# Altium project Do_an_1.PrjPcb
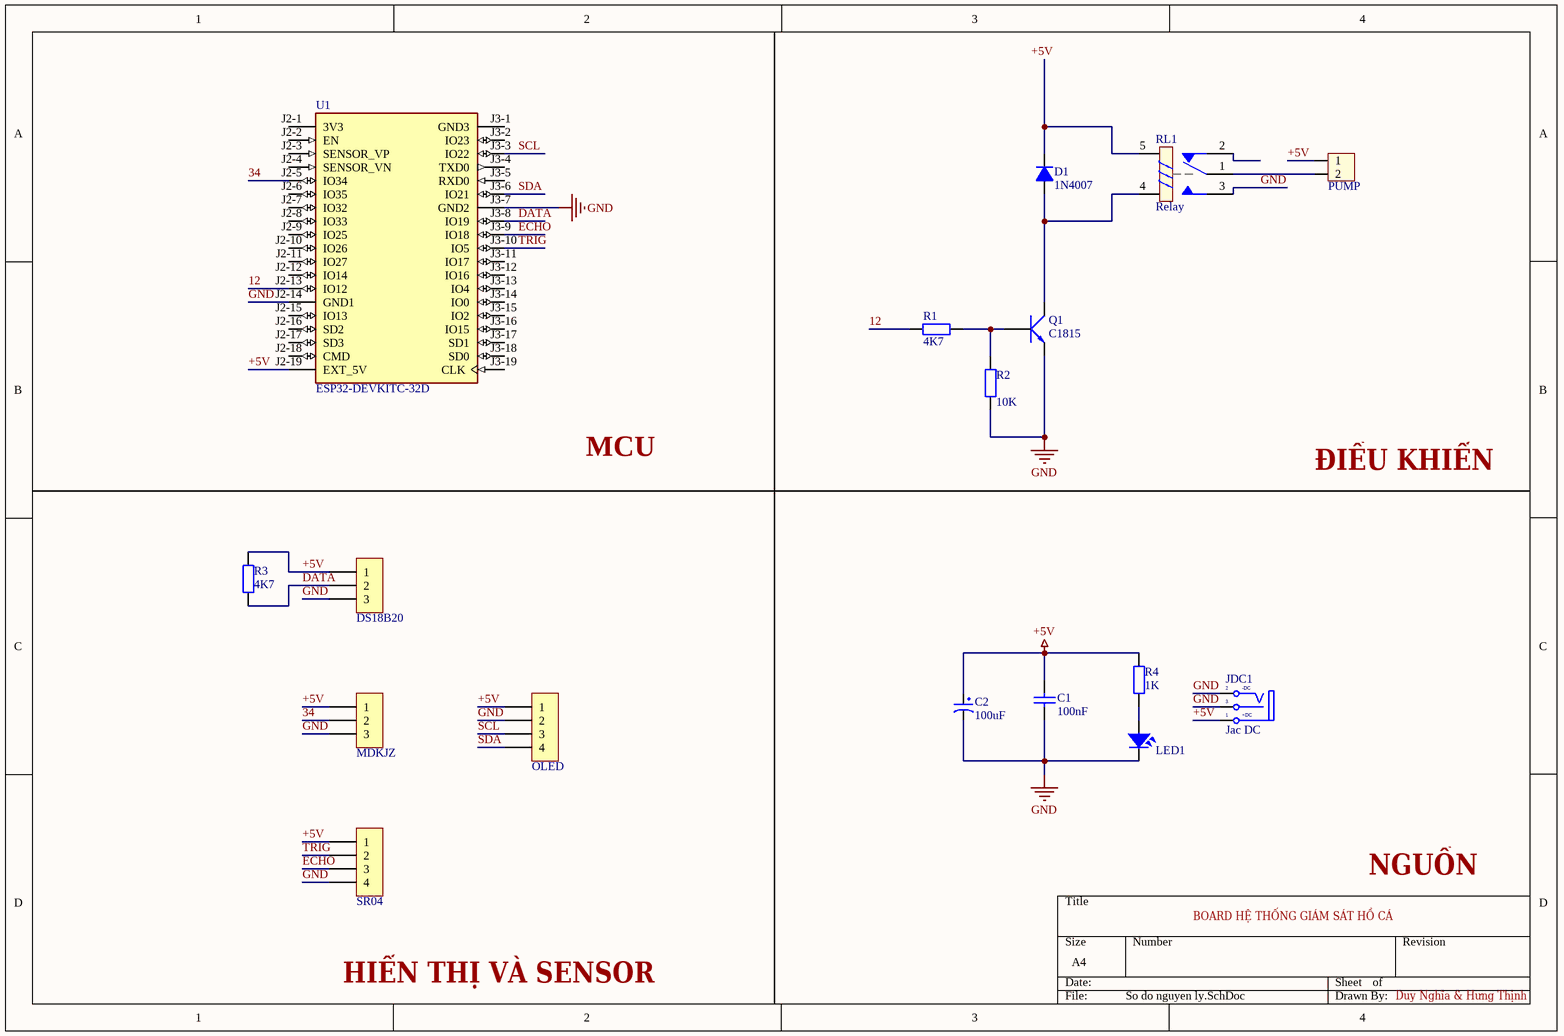
[diagram p0: So do nguyen ly.SchDoc]
1 sheet, 17 parts. Net scope: global (net labels, ports and power ports of the same name join across sheets).
Board file: Final_PCB.PcbDoc

## Sheet So do nguyen ly.SchDoc
size A4; SheetNumber: 1; SheetTotal: 1

### Parts
C1  100nF  [tu gom]
C2  100uF  [tu hoa 5mm]
D1  1N4007  [D1A]
H1  PUMP  [XH2.54M-2]
H2  DS18B20  [Header 3P DC 2.54]
H3  MDKJZ  [Header 3P DC 2.54]
H4  OLED  [XH2.54M-4]
H5  SR04  [XH2.54M-4]
JDC1  Jac DC  [DC-IN]
LED1  LED  [LED-3]  (value not drawn)
Q1  C1815  [TO92]
R1  value 4K7  [AXIAL-0.4]  (hidden comment: Res2)
R2  value 10K  [AXIAL-0.4]  (hidden comment: Res2)
R3  value 4K7  [AXIAL-0.4]  (hidden comment: Res2)
R4  value 1K  [AXIAL-0.4]  (hidden comment: Res2)
RL1  Relay  [RL_SPDT_10A]
U1  ESP32-DEVKITC-32D  [MODULE_ESP32-DEVKITC-32D]

### Nets
+5V: C1.1 C2.1 H1.1 H2.1 H3.1 H4.1 H5.1 JDC1.1(T) R3.2 R4.2 U1.J2-19(EXT_5V)
GND: C1.2 C2.2 H2.3 H3.3 H4.2 H5.4 JDC1.2(TN) JDC1.3(S) LED1.2 Q1.1(E) R2.1 RL1.3 U1.J2-14(GND1) U1.J3-7(GND2)
12: R1.1 U1.J2-13(IO12)
34: H3.2 U1.J2-5(IO34)
DATA: H2.2 R3.1 U1.J3-8(IO19)
ECHO: H5.3 U1.J3-9(IO18)
SCL: H4.3 U1.J3-3(IO22)
SDA: H4.4 U1.J3-6(IO21)
TRIG: H5.2 U1.J3-10(IO5)
NetD1_1: D1.1(A) Q1.2(C) RL1.4
NetD1_2: D1.2(K) RL1.5
NetH1_2: H1.2 RL1.1
NetLED1_1: LED1.1 R4.1
NetQ1_3: Q1.3(B) R1.2 R2.2

Not connected (* = marked no-connect by the designer): RL1 2; U1 J2-1(3V3) J2-2(EN) J2-3(SENSOR_VP) J2-4(SENSOR_VN) J2-6(IO35) J2-7(IO32) J2-8(IO33) J2-9(IO25) J2-10(IO26) J2-11(IO27) J2-12(IO14) J2-15(IO13) J2-16(SD2) J2-17(SD3) J2-18(CMD) J3-1(GND3) J3-2(IO23) J3-4(TXD0) J3-5(RXD0) J3-11(IO17) J3-12(IO16) J3-13(IO4) J3-14(IO0) J3-15(IO2) J3-16(IO15) J3-17(SD1) J3-18(SD0) J3-19(CLK)

### Notes on the sheet
- MCU
- ĐIỀU KHIỂN
- BOARD HỆ THỐNG GIÁM SÁT HỒ CÁ
- NGUỒN
- HIỂN THỊ VÀ SENSOR
- Duy Nghĩa & Hưng Thịnh
- Labels drawn without touching a wire or pin: +5V
- (in symbol DCIN) -DC; +DC

### Library data of the parts
C1 = Tu gom 15pF 50V: Cắm; Don_Vi: Con; So_Chan: 2; Ten_Linh_Kien: Tụ gốm 15P 50V; Ma_Hang: MH004767; Chung_Loai: Cắm; Kieu_Chan: *
C2 = Tu Hoa 100uF 16V 5x7: Cắm; Don_Vi: Con; So_Chan: 2; Ten_Linh_Kien: Tụ Hóa 100uF 16V 5x7MM; Ma_Hang: MH001347; Chung_Loai: Cắm; Kieu_Chan: *
D1 = D1A: Diode 1A; Value: 1N4007
H1 = Header 2P 2.54 Duc Thang: Cắm; Ten_Linh_Kien: Header 2P XH2.54-2P Đực Thẳng; Don_Vi: Con; Ma_Hang: MH001283; Chung_Loai: Cắm
H2 H3 = Header 3P 2.54 Duc Cong: Cắm; Ten_Linh_Kien: Header 3P XH2.54-3P Đực Cong; Don_Vi: Con; Ma_Hang: MH001302; Chung_Loai: Cắm
H4 H5 = Header 4P 2.54 Duc Thang: Cắm; Ten_Linh_Kien: Header 4P XH2.54-4P Đực Thẳng; Don_Vi: Con; Ma_Hang: MH001285; Chung_Loai: Cắm
JDC1 = DCIN: Jac DC input; Value: Jac DC
LED1 = LED: LED Single colour Green and Red; Value: LED 3 ly Single Colour
Q1 = C1815: NPN transistor; Value: C9014
R1-R4 = Res2: Resistor; Published: 8-Jun-2000; LatestRevisionDate: 17-Jul-2002; LatestRevisionNote: Re-released for DXP Platform.; PackageReference: AXIAL-0.4; Publisher: Altium Limited; PackageDescription: Axial Device, Thru-Hole; 2 Leads; 0.4 in Pin Spacing
RL1 = Relay 1: Relay SPDT,10A - 12VDC 5 Pin; Value: Relay SPDT, 10A, 12V
U1 = ESP32-DEVKITC-32D: WiFi Development Tools (802.11) ESP32 General Development Kit, ESP32-WROOM-32D on the board; MF: Espressif Systems; SnapEDA_Link: https://www.snapeda.com/parts/ESP32-DEVKITC-32D/Espressif+Systems/view-part/?ref=snap; Package: None; Value: *; MP: ESP32-DEVKITC-32D; Check_prices: https://www.snapeda.com/parts/ESP32-DEVKITC-32D/Espressif+Systems/view-part/?ref=eda